# EAGLE schematic motor-driver (EAGLE 9.6.2)
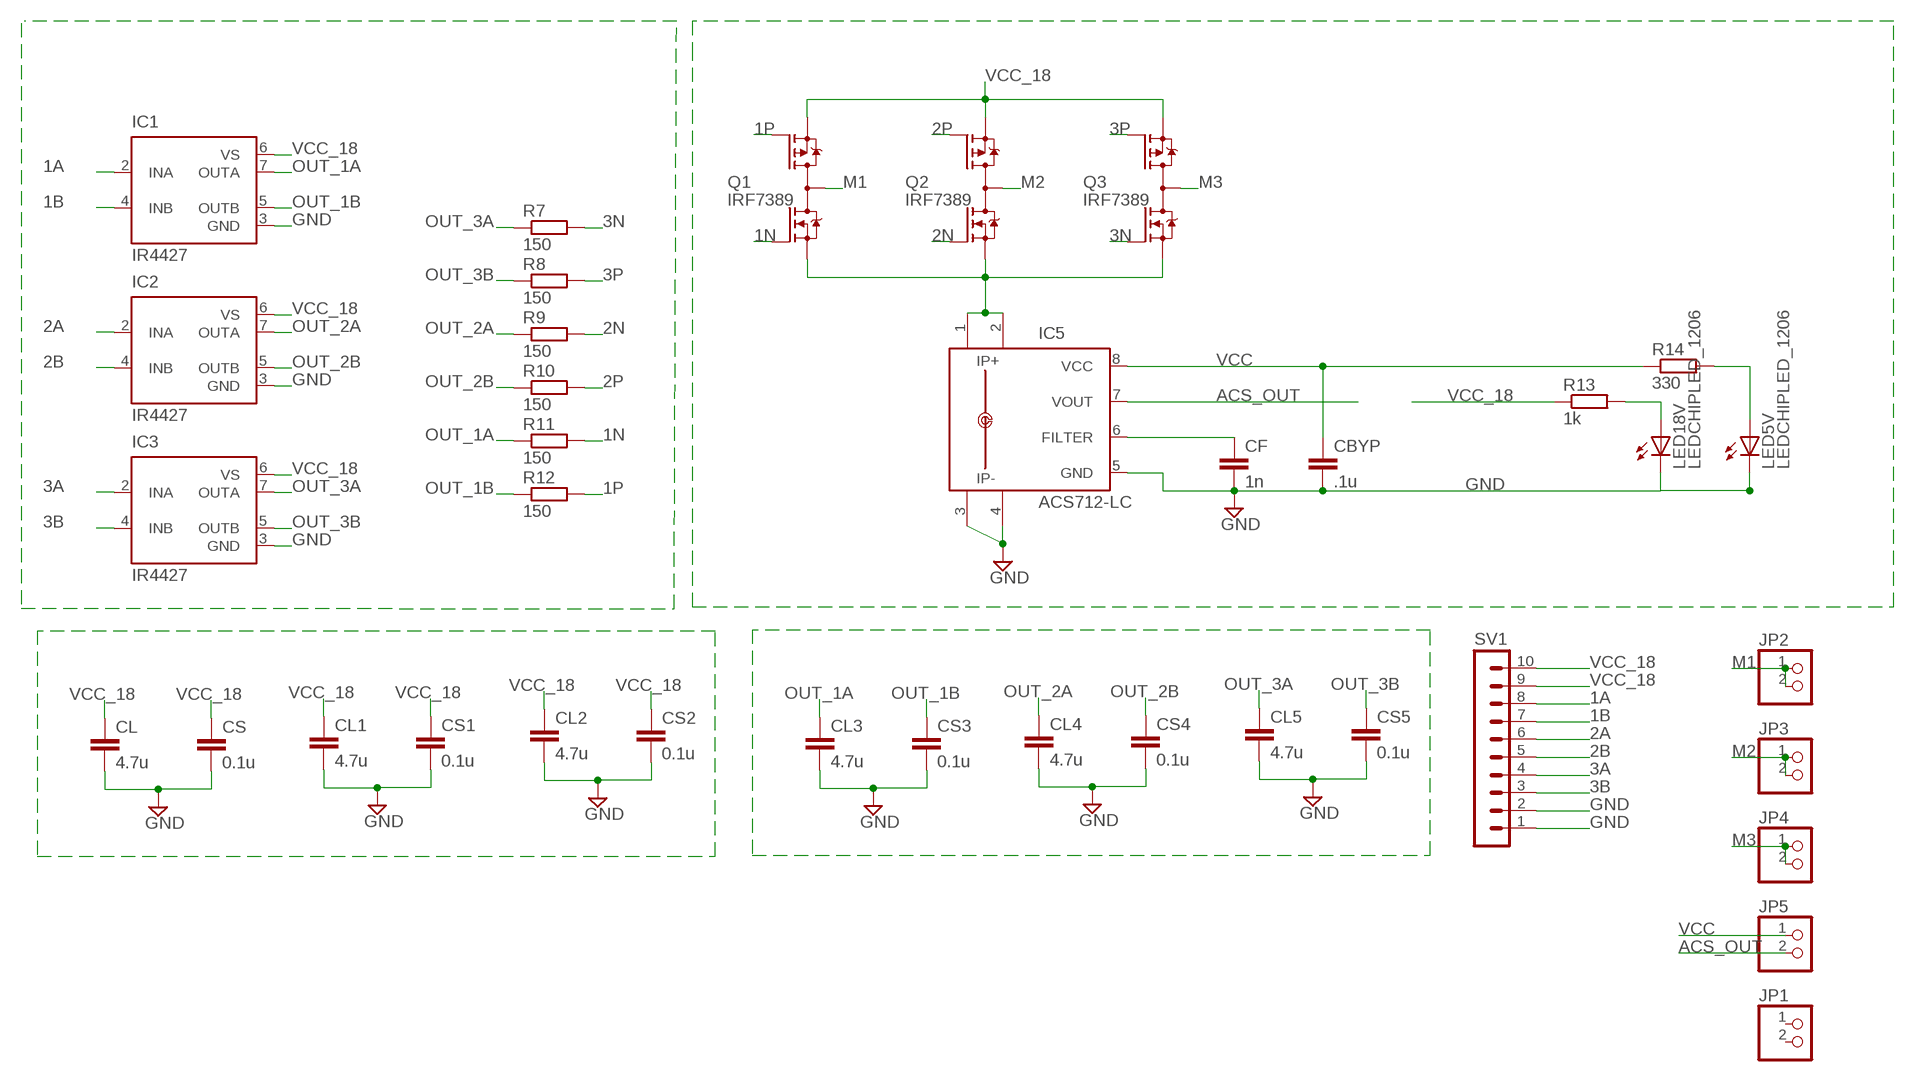
[diagram p0: schematic, sheet 1]

## Parts
CBYP  .1u  CC1206  [C1206]
CF  1n  CC1206  [C1206]
CL  4.7u  CC1206  [C1206]
CL1  4.7u  CC1206  [C1206]
CL2  4.7u  CC1206  [C1206]
CL3  4.7u  CC1206  [C1206]
CL4  4.7u  CC1206  [C1206]
CL5  4.7u  CC1206  [C1206]
CS  0.1u  CC1206  [C1206]
CS1  0.1u  CC1206  [C1206]
CS2  0.1u  CC1206  [C1206]
CS3  0.1u  CC1206  [C1206]
CS4  0.1u  CC1206  [C1206]
CS5  0.1u  CC1206  [C1206]
IC1  IR4427  [DIL08]
IC2  IR4427  [DIL08]
IC3  IR4427  [DIL08]
IC5  ACS712-LC  [SOIC8]
JP1  PINHD-1X2  [1X02]
JP2  PINHD-1X2  [1X02]
JP3  PINHD-1X2  [1X02]
JP4  PINHD-1X2  [1X02]
JP5  PINHD-1X2  [1X02]
LED5V  LEDCHIPLED_1206  [CHIPLED_1206]
LED18V  LEDCHIPLED_1206  [CHIPLED_1206]
Q1  IRF7389  [SO08-IRF]
Q2  IRF7389  [SO08-IRF]
Q3  IRF7389  [SO08-IRF]
R7  150  RR1206  [R1206]
R8  150  RR1206  [R1206]
R9  150  RR1206  [R1206]
R10  150  RR1206  [R1206]
R11  150  RR1206  [R1206]
R12  150  RR1206  [R1206]
R13  1k  RR1206  [R1206]
R14  330  RR1206  [R1206]
SV1  MA10-1  [MA10-1]

## Nets
1A [signal]: IC1.2(INA) SV1.8
1B [signal]: IC1.4(INB) SV1.7
1N [signal]: Q1.2(N-G) R11.2
1P [signal]: Q1.4(P-G) R12.2
2A [signal]: IC2.2(INA) SV1.6
2B [signal]: IC2.4(INB) SV1.5
2N [signal]: Q2.2(N-G) R9.2
2P [signal]: Q2.4(P-G) R10.2
3A [signal]: IC3.2(INA) SV1.4
3B [signal]: IC3.4(INB) SV1.3
3N [signal]: Q3.2(N-G) R7.2
3P [signal]: Q3.4(P-G) R8.2
ACS_OUT [signal]: IC5.7(VOUT) JP5.2
FILTER_ACS [signal]: CF.1 IC5.6(FILTER)
GND [gnd]: CBYP.2 CF.2 CL1.2 CL2.2 CL3.2 CL4.2 CL5.2 CL.2 CS1.2 CS2.2 CS3.2 CS4.2 CS5.2 CS.2 IC1.3(GND) IC2.3(GND) IC3.3(GND) IC5.3(IP-) IC5.4(IP-1) IC5.5(GND) LED5V.C LED18V.C SV1.1 SV1.2
M1 [motor]: JP2.1 JP2.2 Q1.5(D) Q1.6(D) Q1.7(D) Q1.8(D)
M2 [motor]: JP3.1 JP3.2 Q2.5(D) Q2.6(D) Q2.7(D) Q2.8(D)
M3 [motor]: JP4.1 JP4.2 Q3.5(D) Q3.6(D) Q3.7(D) Q3.8(D)
N$2 [5v]: LED18V.A R13.2
N$4 [signal]: LED5V.A R14.2
OUT_1A [signal]: CL3.1 IC1.7(OUTA) R11.1
OUT_1B [signal]: CS3.1 IC1.5(OUTB) R12.1
OUT_2A [signal]: CL4.1 IC2.7(OUTA) R9.1
OUT_2B [signal]: CS4.1 IC2.5(OUTB) R10.1
OUT_3A [signal]: CL5.1 IC3.7(OUTA) R7.1
OUT_3B [signal]: CS5.1 IC3.5(OUTB) R8.1
SINK [motor]: IC5.1(IP+) IC5.2(IP+1) Q1.1(N-S) Q2.1(N-S) Q3.1(N-S)
VCC [5v]: CBYP.1 IC5.8(VCC) JP5.1 R14.1
VCC_18: CL1.1 CL2.1 CL.1 CS1.1 CS2.1 CS.1 IC1.6(VS) IC2.6(VS) IC3.6(VS) Q1.3(P-S) Q2.3(P-S) Q3.3(P-S) R13.1 SV1.9 SV1.10
Unconnected: JP1.1 JP1.2

## Library data of the parts
CBYP CF CL CL1-CL5 CS CS1-CS5 = eagle-ltspice:C: CAPACITOR, European symbol; SPICEMODEL: NONE; SPICEPREFIX: C
IC1-IC3 = ir:IR4427: DUAL LOW SIDE DRIVER Source: ID4426.pdf; MF: INTERNATIONAL RECTIFIER(IR); MPN: IR4427; OC_FARNELL: 1023267; OC_NEWARK: 27C6914
IC5 = allegro-2:ACS712-LC
JP1-JP5 = pinhead:PINHD-1X2: PIN HEADER
LED5V LED18V = audio amplifier example:LED
Q1-Q3 = transistor-fet:IRF7389: Complimentary Half Bridge HEXFET Power MOSFET Source: http://www.irf.com/product-info/datasheets/data/irf7389.pdf
R7-R14 = eagle-ltspice:R: RESISTOR, European symbol; SPICEMODEL: NONE; SPICEPREFIX: R
SV1 = con-lstb:MA10-1: PIN HEADER; OC_FARNELL: unknown; OC_NEWARK: unknown

## Net classes
0 18v: width 0.725 mm, drill 0.4 mm, clearance 0.152 mm
1 5v: width 0.4 mm, drill 0.4 mm, clearance 0.152 mm
2 motor: width 0.725 mm, drill 0.4 mm, clearance 0.152 mm
3 signal: width 0.3 mm, drill 0.4 mm, clearance 0.152 mm
4 gnd: width 0.725 mm, drill 0.4 mm, clearance 0.152 mm